# Altium schematic sheet PRO2.SchDoc
size A3
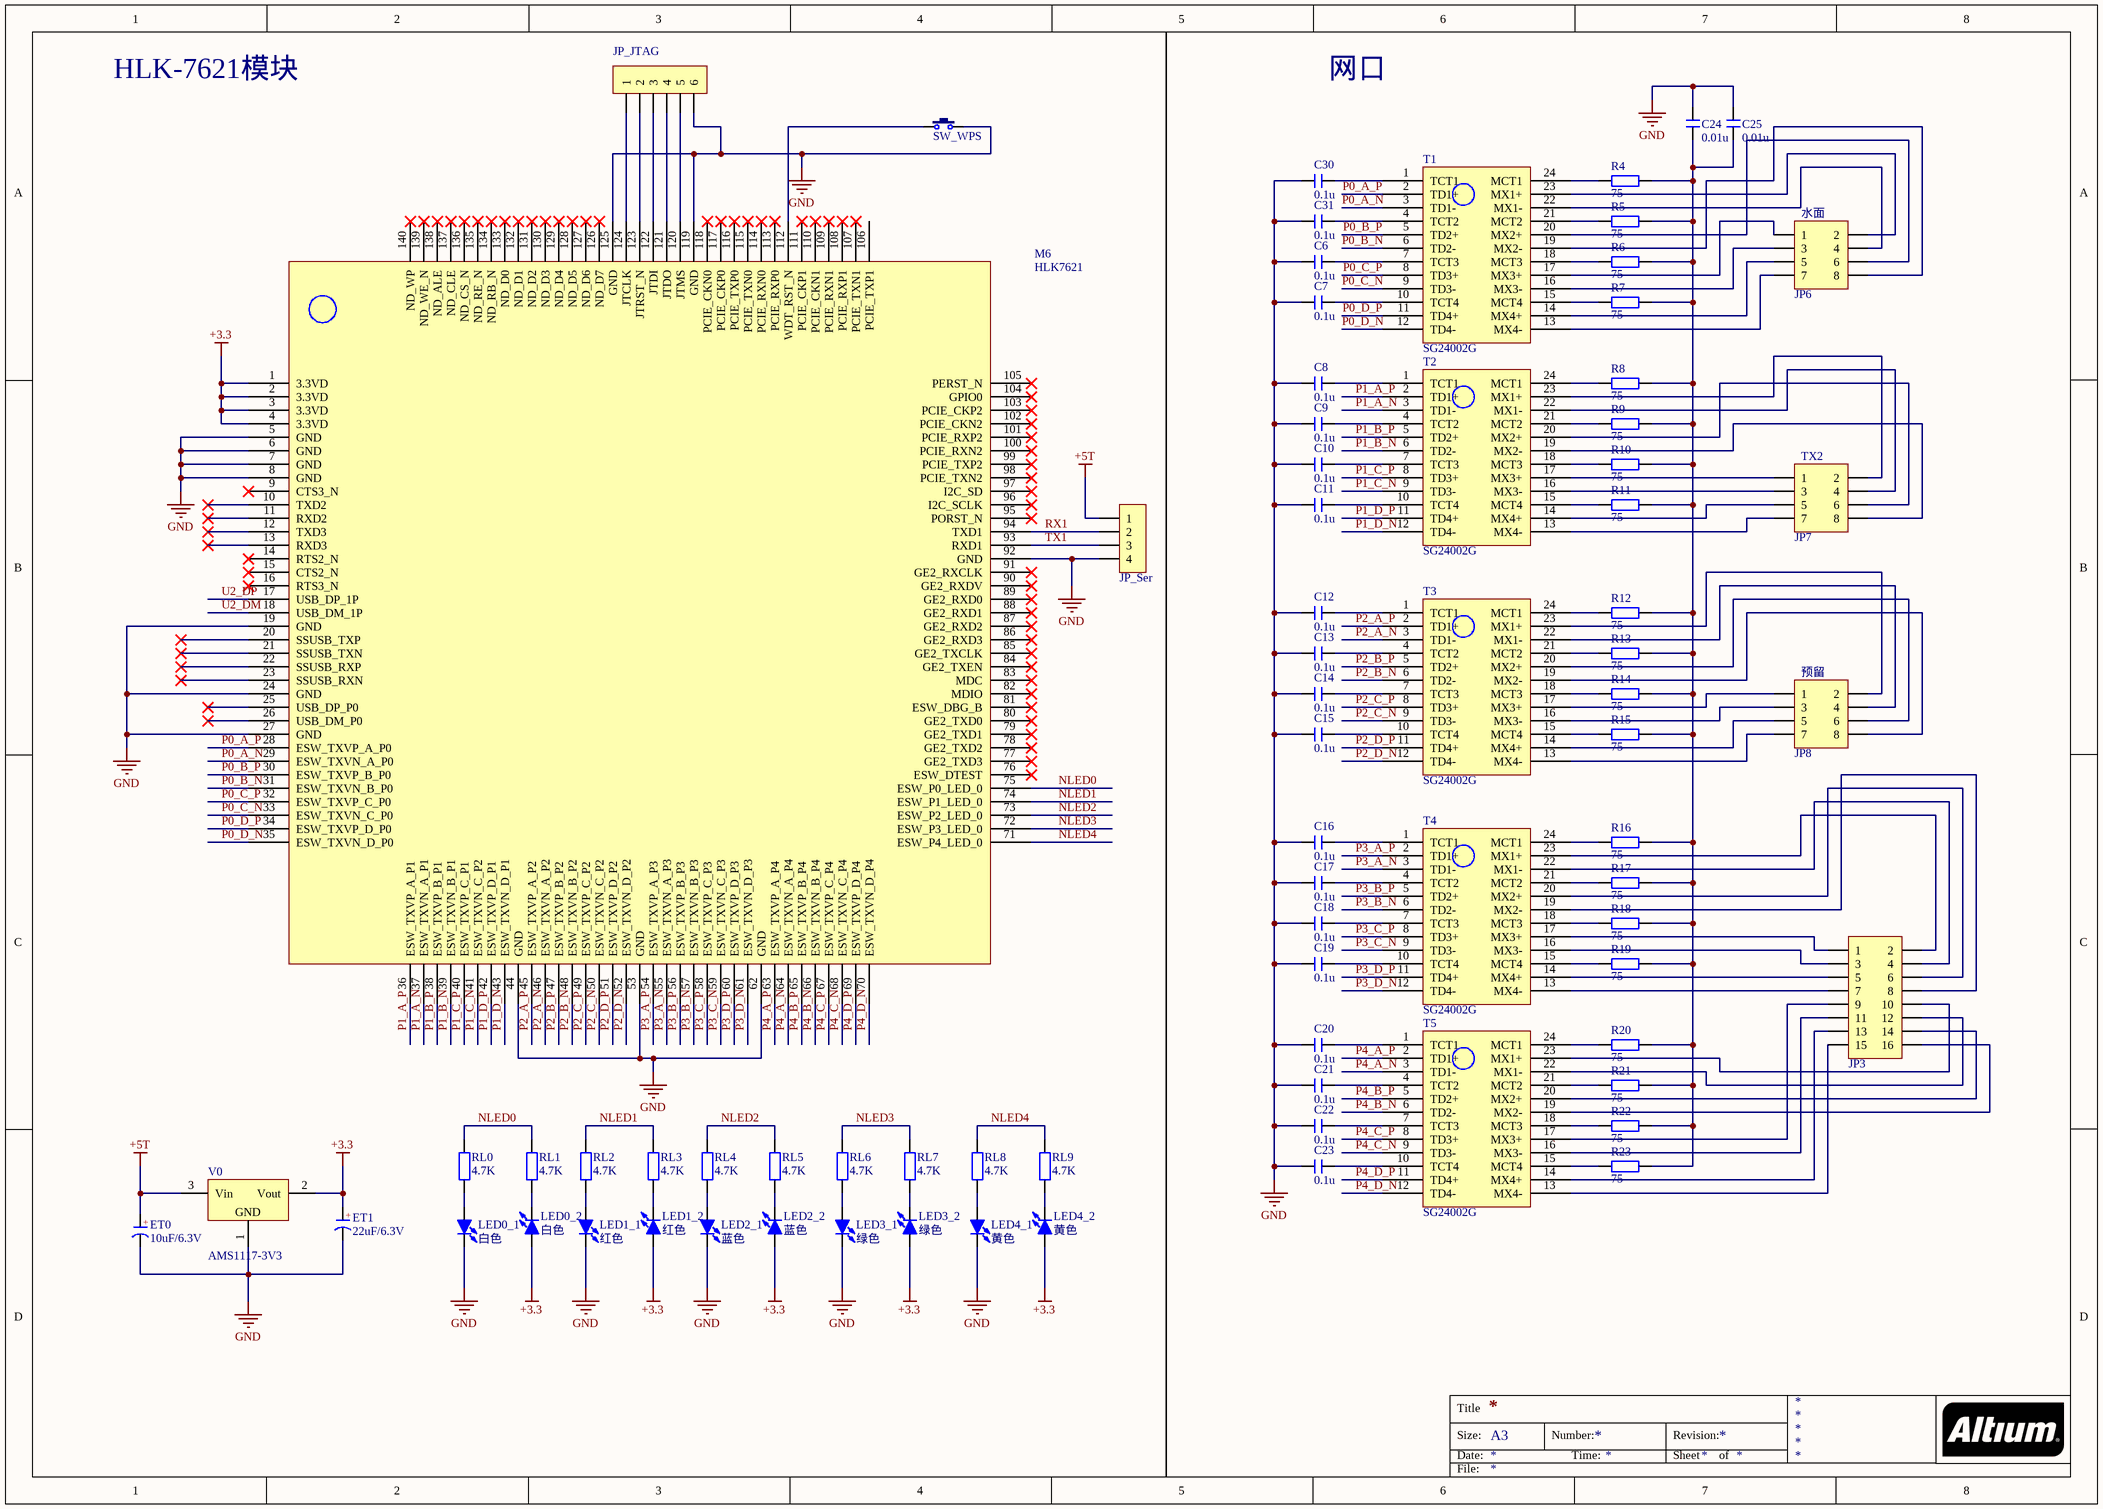
[diagram p0: PRO2.SchDoc]

## Parts
C6  0.1u  [C 0603_M]
C7  0.1u  [C 0603_M]
C8  0.1u  [C 0603_M]
C9  0.1u  [C 0603_M]
C10  0.1u  [C 0603_M]
C11  0.1u  [C 0603_M]
C12  0.1u  [C 0603_M]
C13  0.1u  [C 0603_M]
C14  0.1u  [C 0603_M]
C15  0.1u  [C 0603_M]
C16  0.1u  [C 0603_M]
C17  0.1u  [C 0603_M]
C18  0.1u  [C 0603_M]
C19  0.1u  [C 0603_M]
C20  0.1u  [C 0603_M]
C21  0.1u  [C 0603_M]
C22  0.1u  [C 0603_M]
C23  0.1u  [C 0603_M]
C24  0.01u  [C 0603_M]
C25  0.01u  [C 0603_M]
C30  0.1u  [C 0603_M]
C31  0.1u  [C 0603_M]
ET0  10uF/6.3V  [CD A(3216)]
ET1  22uF/6.3V  [CD A(3216)]
JP3  Header 8X2  [IDC2.54-LI-2x8P]  (value not drawn)
JP6  水面  [PHB2.0-LI-2x4P]
JP7  TX2  [PHB2.0-LI-2x4P]
JP8  预留  [PHB2.0-LI-2x4P]
JP_JTAG  HDR-1X6  [HDR2.54-LI-6P]  (value not drawn)
JP_Ser  HDR-1X4  [HDR2.54-LI-4P]  (value not drawn)
LED0_1  白色  [LED 0603W]
LED0_2  白色  [LED 0603W]
LED1_1  红色  [LED 0603R]
LED1_2  红色  [LED 0603R]
LED2_1  蓝色  [LED 0603B]
LED2_2  蓝色  [LED 0603B]
LED3_1  绿色  [LED 0603G]
LED3_2  绿色  [LED 0603G]
LED4_1  黄色  [LED 0603Y]
LED4_2  黄色  [LED 0603Y]
M6  HLK7621  [HLK7621]
R4  75  [R 0603_M]
R5  75  [R 0603_M]
R6  75  [R 0603_M]
R7  75  [R 0603_M]
R8  75  [R 0603_M]
R9  75  [R 0603_M]
R10  75  [R 0603_M]
R11  75  [R 0603_M]
R12  75  [R 0603_M]
R13  75  [R 0603_M]
R14  75  [R 0603_M]
R15  75  [R 0603_M]
R16  75  [R 0603_M]
R17  75  [R 0603_M]
R18  75  [R 0603_M]
R19  75  [R 0603_M]
R20  75  [R 0603_M]
R21  75  [R 0603_M]
R22  75  [R 0603_M]
R23  75  [R 0603_M]
RL0  4.7K  [R 0603_M]
RL1  4.7K  [R 0603_M]
RL2  4.7K  [R 0603_M]
RL3  4.7K  [R 0603_M]
RL4  4.7K  [R 0603_M]
RL5  4.7K  [R 0603_M]
RL6  4.7K  [R 0603_M]
RL7  4.7K  [R 0603_M]
RL8  4.7K  [R 0603_M]
RL9  4.7K  [R 0603_M]
SW_WPS  3x6x5  [TSW SMD-3*6*2.5]  (value not drawn)
T1  SG24002G  [SG24002G]
T2  SG24002G  [SG24002G]
T3  SG24002G  [SG24002G]
T4  SG24002G  [SG24002G]
T5  SG24002G  [SG24002G]
V0  AMS1117-3V3  [SOT223_M]

## Nets
+3.3: ET1.1(A) LED0_2.1(A) LED1_2.1(A) LED2_2.1(A) LED3_2.1(A) LED4_2.1(A) M6.1(3.3VD) M6.2(3.3VD) M6.3(3.3VD) M6.4(3.3VD) V0.2(Vout)
+5T: ET0.1(A) JP_Ser.1 V0.3(Vin)
GND: C6.1 C7.1 C8.1 C9.1 C10.1 C11.1 C12.1 C13.1 C14.1 C15.1 C16.1 C17.1 C18.1 C19.1 C20.1 C21.1 C22.1 C23.1 C24.2 C25.2 C30.1 C31.1 ET0.2(K) ET1.2(K) JP_JTAG.6 JP_Ser.4 LED0_1.2(K) LED1_1.2(K) LED2_1.2(K) LED3_1.2(K) LED4_1.2(K) M6.5(GND) M6.6(GND) M6.7(GND) M6.8(GND) M6.19(GND) M6.24(GND) M6.27(GND) M6.44(GND) M6.53(GND) M6.62(GND) M6.92(GND) M6.119(GND) M6.125(GND) SW_WPS.2 V0.1(GND)
NLED0: M6.75(ESW_P0_LED_0) RL0.2 RL1.2
NLED1: M6.74(ESW_P1_LED_0) RL2.2 RL3.2
NLED2: M6.73(ESW_P2_LED_0) RL4.2 RL5.2
NLED3: M6.72(ESW_P3_LED_0) RL6.2 RL7.2
NLED4: M6.71(ESW_P4_LED_0) RL8.2 RL9.2
P0_A_N: M6.29(ESW_TXVN_A_P0) T1.3(TD1-)
P0_A_P: M6.28(ESW_TXVP_A_P0) T1.2(TD1+)
P0_B_N: M6.31(ESW_TXVN_B_P0) T1.6(TD2-)
P0_B_P: M6.30(ESW_TXVP_B_P0) T1.5(TD2+)
P0_C_N: M6.33(ESW_TXVN_C_P0) T1.9(TD3-)
P0_C_P: M6.32(ESW_TXVP_C_P0) T1.8(TD3+)
P0_D_N: M6.35(ESW_TXVN_D_P0) T1.12(TD4-)
P0_D_P: M6.34(ESW_TXVP_D_P0) T1.11(TD4+)
P1_A_N: M6.37(ESW_TXVN_A_P1) T2.3(TD1-)
P1_A_P: M6.36(ESW_TXVP_A_P1) T2.2(TD1+)
P1_B_N: M6.39(ESW_TXVN_B_P1) T2.6(TD2-)
P1_B_P: M6.38(ESW_TXVP_B_P1) T2.5(TD2+)
P1_C_N: M6.41(ESW_TXVN_C_P2) T2.9(TD3-)
P1_C_P: M6.40(ESW_TXVP_C_P1) T2.8(TD3+)
P1_D_N: M6.43(ESW_TXVN_D_P1) T2.12(TD4-)
P1_D_P: M6.42(ESW_TXVP_D_P1) T2.11(TD4+)
P2_A_N: M6.46(ESW_TXVN_A_P2) T3.3(TD1-)
P2_A_P: M6.45(ESW_TXVP_A_P2) T3.2(TD1+)
P2_B_N: M6.48(ESW_TXVN_B_P2) T3.6(TD2-)
P2_B_P: M6.47(ESW_TXVP_B_P2) T3.5(TD2+)
P2_C_N: M6.50(ESW_TXVN_C_P2) T3.9(TD3-)
P2_C_P: M6.49(ESW_TXVP_C_P2) T3.8(TD3+)
P2_D_N: M6.52(ESW_TXVN_D_P2) T3.12(TD4-)
P2_D_P: M6.51(ESW_TXVP_D_P2) T3.11(TD4+)
P3_A_N: M6.55(ESW_TXVN_A_P3) T4.3(TD1-)
P3_A_P: M6.54(ESW_TXVP_A_P3) T4.2(TD1+)
P3_B_N: M6.57(ESW_TXVN_B_P3) T4.6(TD2-)
P3_B_P: M6.56(ESW_TXVP_B_P3) T4.5(TD2+)
P3_C_N: M6.59(ESW_TXVN_C_P3) T4.9(TD3-)
P3_C_P: M6.58(ESW_TXVP_C_P3) T4.8(TD3+)
P3_D_N: M6.61(ESW_TXVN_D_P3) T4.12(TD4-)
P3_D_P: M6.60(ESW_TXVP_D_P3) T4.11(TD4+)
P4_A_N: M6.64(ESW_TXVN_A_P4) T5.3(TD1-)
P4_A_P: M6.63(ESW_TXVP_A_P4) T5.2(TD1+)
P4_B_N: M6.66(ESW_TXVN_B_P4) T5.6(TD2-)
P4_B_P: M6.65(ESW_TXVP_B_P4) T5.5(TD2+)
P4_C_N: M6.68(ESW_TXVN_C_P4) T5.9(TD3-)
P4_C_P: M6.67(ESW_TXVP_C_P4) T5.8(TD3+)
P4_D_N: M6.70(ESW_TXVN_D_P4) T5.12(TD4-)
P4_D_P: M6.69(ESW_TXVP_D_P4) T5.11(TD4+)
RX1: JP_Ser.2 M6.94(TXD1)
TX1: JP_Ser.3 M6.93(RXD1)
U2_DM: M6.18(USB_DM_1P)
U2_DP: M6.17(USB_DP_1P)
NetC6_2: C6.2 T1.7(TCT3)
NetC7_2: C7.2 T1.10(TCT4)
NetC8_2: C8.2 T2.1(TCT1)
NetC9_2: C9.2 T2.4(TCT2)
NetC10_2: C10.2 T2.7(TCT3)
NetC11_2: C11.2 T2.10(TCT4)
NetC12_2: C12.2 T3.1(TCT1)
NetC13_2: C13.2 T3.4(TCT2)
NetC14_2: C14.2 T3.7(TCT3)
NetC15_2: C15.2 T3.10(TCT4)
NetC16_2: C16.2 T4.1(TCT1)
NetC17_2: C17.2 T4.4(TCT2)
NetC18_2: C18.2 T4.7(TCT3)
NetC19_2: C19.2 T4.10(TCT4)
NetC20_2: C20.2 T5.1(TCT1)
NetC21_2: C21.2 T5.4(TCT2)
NetC22_2: C22.2 T5.7(TCT3)
NetC23_2: C23.2 T5.10(TCT4)
NetC24_1: C24.1 C25.1 R4.2 R5.2 R6.2 R7.2 R8.2 R9.2 R10.2 R11.2 R12.2 R13.2 R14.2 R15.2 R16.2 R17.2 R18.2 R19.2 R20.2 R21.2 R22.2 R23.2
NetC30_2: C30.2 T1.1(TCT1)
NetC31_2: C31.2 T1.4(TCT2)
NetJP3_1: JP3.1 T4.17(MX3+)
NetJP3_2: JP3.2 T4.23(MX1+)
NetJP3_3: JP3.3 T4.16(MX3-)
NetJP3_4: JP3.4 T4.22(MX1-)
NetJP3_5: JP3.5 T4.14(MX4+)
NetJP3_6: JP3.6 T4.20(MX2+)
NetJP3_7: JP3.7 T4.13(MX4-)
NetJP3_8: JP3.8 T4.19(MX2-)
NetJP3_9: JP3.9 T5.17(MX3+)
NetJP3_10: JP3.10 T5.23(MX1+)
NetJP3_11: JP3.11 T5.16(MX3-)
NetJP3_12: JP3.12 T5.22(MX1-)
NetJP3_13: JP3.13 T5.14(MX4+)
NetJP3_14: JP3.14 T5.20(MX2+)
NetJP3_15: JP3.15 T5.13(MX4-)
NetJP3_16: JP3.16 T5.19(MX2-)
NetJP6_1: JP6.1 T1.17(MX3+)
NetJP6_2: JP6.2 T1.23(MX1+)
NetJP6_3: JP6.3 T1.16(MX3-)
NetJP6_4: JP6.4 T1.22(MX1-)
NetJP6_5: JP6.5 T1.14(MX4+)
NetJP6_6: JP6.6 T1.20(MX2+)
NetJP6_7: JP6.7 T1.13(MX4-)
NetJP6_8: JP6.8 T1.19(MX2-)
NetJP7_1: JP7.1 T2.17(MX3+)
NetJP7_2: JP7.2 T2.23(MX1+)
NetJP7_3: JP7.3 T2.16(MX3-)
NetJP7_4: JP7.4 T2.22(MX1-)
NetJP7_5: JP7.5 T2.14(MX4+)
NetJP7_6: JP7.6 T2.20(MX2+)
NetJP7_7: JP7.7 T2.13(MX4-)
NetJP7_8: JP7.8 T2.19(MX2-)
NetJP8_1: JP8.1 T3.17(MX3+)
NetJP8_2: JP8.2 T3.23(MX1+)
NetJP8_3: JP8.3 T3.16(MX3-)
NetJP8_4: JP8.4 T3.22(MX1-)
NetJP8_5: JP8.5 T3.14(MX4+)
NetJP8_6: JP8.6 T3.20(MX2+)
NetJP8_7: JP8.7 T3.13(MX4-)
NetJP8_8: JP8.8 T3.19(MX2-)
NetJP_JTAG_1: JP_JTAG.1 M6.124(JTCLK)
NetJP_JTAG_2: JP_JTAG.2 M6.123(JTRST_N)
NetJP_JTAG_3: JP_JTAG.3 M6.122(JTDI)
NetJP_JTAG_4: JP_JTAG.4 M6.121(JTDO)
NetJP_JTAG_5: JP_JTAG.5 M6.120(JTMS)
NetLED0_1_1: LED0_1.1(A) RL0.1
NetLED0_2_2: LED0_2.2(K) RL1.1
NetLED1_1_1: LED1_1.1(A) RL2.1
NetLED1_2_2: LED1_2.2(K) RL3.1
NetLED2_1_1: LED2_1.1(A) RL4.1
NetLED2_2_2: LED2_2.2(K) RL5.1
NetLED3_1_1: LED3_1.1(A) RL6.1
NetLED3_2_2: LED3_2.2(K) RL7.1
NetLED4_1_1: LED4_1.1(A) RL8.1
NetLED4_2_2: LED4_2.2(K) RL9.1
NetM6_112: M6.112(WDT_RST_N) SW_WPS.1
NetR4_1: R4.1 T1.24(MCT1)
NetR5_1: R5.1 T1.21(MCT2)
NetR6_1: R6.1 T1.18(MCT3)
NetR7_1: R7.1 T1.15(MCT4)
NetR8_1: R8.1 T2.24(MCT1)
NetR9_1: R9.1 T2.21(MCT2)
NetR10_1: R10.1 T2.18(MCT3)
NetR11_1: R11.1 T2.15(MCT4)
NetR12_1: R12.1 T3.24(MCT1)
NetR13_1: R13.1 T3.21(MCT2)
NetR14_1: R14.1 T3.18(MCT3)
NetR15_1: R15.1 T3.15(MCT4)
NetR16_1: R16.1 T4.24(MCT1)
NetR17_1: R17.1 T4.21(MCT2)
NetR18_1: R18.1 T4.18(MCT3)
NetR19_1: R19.1 T4.15(MCT4)
NetR20_1: R20.1 T5.24(MCT1)
NetR21_1: R21.1 T5.21(MCT2)
NetR22_1: R22.1 T5.18(MCT3)
NetR23_1: R23.1 T5.15(MCT4)

Not connected (* = marked no-connect by the designer): M6 9(CTS3_N)* 10(TXD2)* 11(RXD2)* 12(TXD3)* 13(RXD3)* 14(RTS2_N)* 15(CTS2_N)* 16(RTS3_N)* 20(SSUSB_TXP)* 21(SSUSB_TXN)* 22(SSUSB_RXP)* 23(SSUSB_RXN)* 25(USB_DP_P0)* 26(USB_DM_P0)* 76(ESW_DTEST)* 77(GE2_TXD3)* 78(GE2_TXD2)* 79(GE2_TXD1)* 80(GE2_TXD0)* 81(ESW_DBG_B)* 82(MDIO)* 83(MDC)* 84(GE2_TXEN)* 85(GE2_TXCLK)* 86(GE2_RXD3)* 87(GE2_RXD2)* 88(GE2_RXD1)* 89(GE2_RXD0)* 90(GE2_RXDV)* 91(GE2_RXCLK)* 95(PORST_N)* 96(I2C_SCLK)* 97(I2C_SD)* 98(PCIE_TXN2)* 99(PCIE_TXP2)* 100(PCIE_RXN2)* 101(PCIE_RXP2)* 102(PCIE_CKN2)* 103(PCIE_CKP2)* 104(GPIO0)* 105(PERST_N)* 106(PCIE_TXP1) 107(PCIE_TXN1)* 108(PCIE_RXP1)* 109(PCIE_RXN1)* 110(PCIE_CKN1)* 111(PCIE_CKP1)* 113(PCIE_RXP0)* 114(PCIE_RXN0)* 115(PCIE_TXN0)* 116(PCIE_TXP0)* 117(PCIE_CKP0)* 118(PCIE_CKN0)* 126(ND_D7)* 127(ND_D6)* 128(ND_D5)* 129(ND_D4)* 130(ND_D3)* 131(ND_D2)* 132(ND_D1)* 133(ND_D0)* 134(ND_RB_N)* 135(ND_RE_N)* 136(ND_CS_N)* 137(ND_CLE)* 138(ND_ALE)* 139(ND_WE_N)* 140(ND_WP)*

## Notes on the sheet
- HLK-7621模块
- 网口
- Title
- Size:
- Date:
- A3
- Number:
- Time:
- Revision:
- Sheet
- of
- File:
- (in symbol C-CD) +

## Library data of the parts
C6-C25 C30 C31 = C: 无极性贴片电容; 版权归属: 源创客; BOM名称: 无极性贴片电容; 学习资源: www.ooocke.com
ET0 ET1 = C-CD: 贴片钽电容; 版权归属: 源创客; BOM名称: 贴片钽电容; 学习资源: www.ooocke.com
JP3 = Header 8X2: 8*2P接插件; 版权归属: 源创客; BOM名称: 8*2P接插件; 学习资源: www.ooocke.com
JP6-JP8 = Header 4X2: 4*2P接插件; 版权归属: 源创客; BOM名称: 4*2P接插件; 学习资源: www.ooocke.com
JP_JTAG = Header 6: 6P接插件; 版权归属: 源创客; BOM名称: 6P接插件; 学习资源: www.ooocke.com
JP_Ser = Header 4: 4P接插件; 版权归属: 源创客; BOM名称: 4P接插件; 学习资源: www.ooocke.com
LED0_1 LED0_2 LED1_1 LED1_2 LED2_1 LED2_2 LED3_1 LED3_2 LED4_1 LED4_2 = LED-SMD: 贴片LED; 版权归属: 源创客; BOM名称: 贴片LED; 学习资源: www.ooocke.com
R4-R23 RL0-RL9 = R: 贴片电阻; 版权归属: 源创客; BOM名称: 贴片电阻; 学习资源: www.ooocke.com
SW_WPS = TSW 3x6: 3x6轻触开关; 版权归属: 源创客; BOM名称: 3x6轻触开关; 学习资源: www.ooocke.com
V0 = AMS1117: 三端稳压芯片; BOM名称: 稳压芯片; 版权归属: 源创客; 学习资源: www.ooocke.com